# Altium schematic sheet Backlight.SchDoc
size A4
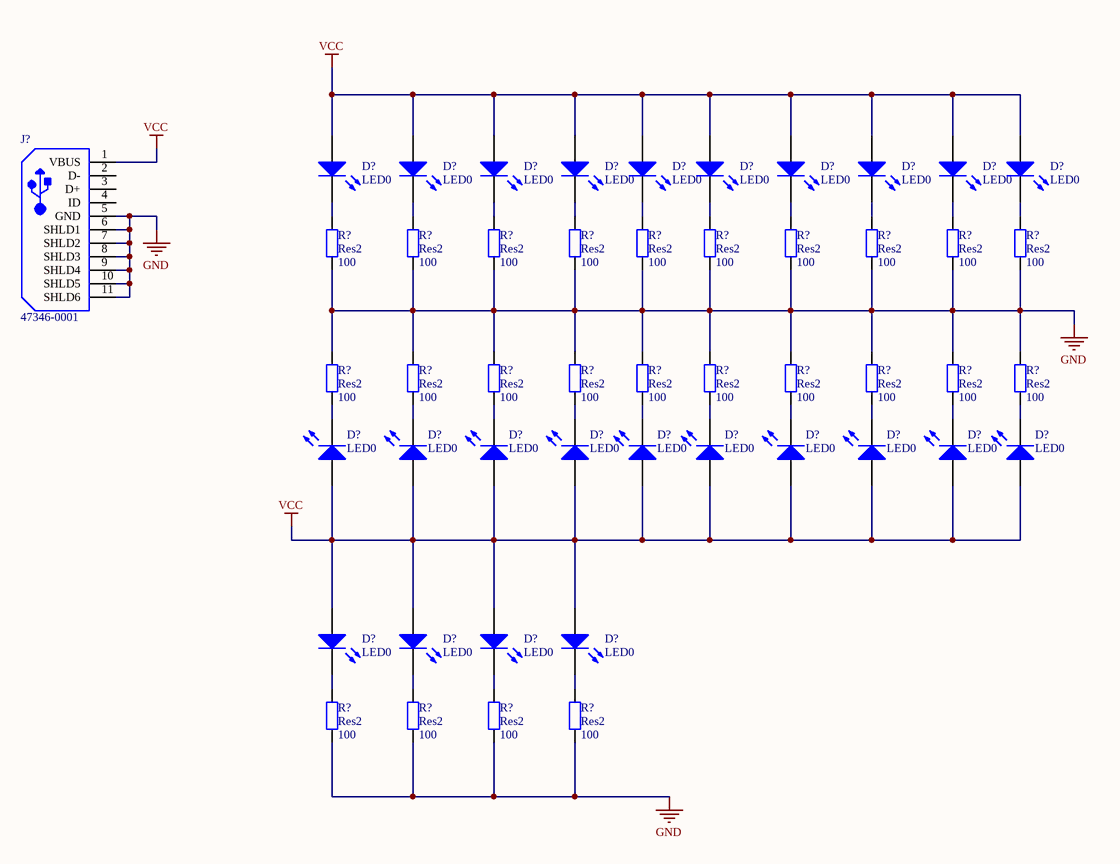
[diagram p0: Backlight.SchDoc]

## Parts
(Parts that share a designator on the sheet are numbered #1, #2 ... from top to bottom, then left to right.)
D?#1  LED0  [DIOC2012X06N]
D?#2  LED0  [DIOC2012X06N]
D?#3  LED0  [DIOC2012X06N]
D?#4  LED0  [DIOC2012X06N]
D?#5  LED0  [DIOC2012X06N]
D?#6  LED0  [DIOC2012X06N]
D?#7  LED0  [DIOC2012X06N]
D?#8  LED0  [DIOC2012X06N]
D?#9  LED0  [DIOC2012X06N]
D?#10  LED0  [DIOC2012X06N]
D?#11  LED0  [DIOC2012X06N]
D?#12  LED0  [DIOC2012X06N]
D?#13  LED0  [DIOC2012X06N]
D?#14  LED0  [DIOC2012X06N]
D?#15  LED0  [DIOC2012X06N]
D?#16  LED0  [DIOC2012X06N]
D?#17  LED0  [DIOC2012X06N]
D?#18  LED0  [DIOC2012X06N]
D?#19  LED0  [DIOC2012X06N]
D?#20  LED0  [DIOC2012X06N]
D?#21  LED0  [DIOC2012X06N]
D?#22  LED0  [DIOC2012X06N]
D?#23  LED0  [DIOC2012X06N]
D?#24  LED0  [DIOC2012X06N]
J?  47346-0001  [MOLX-47346-0001-5_V]
R?#1  Res2  value 100  [RESC2012X06N]
R?#2  Res2  value 100  [RESC2012X06N]
R?#3  Res2  value 100  [RESC2012X06N]
R?#4  Res2  value 100  [RESC2012X06N]
R?#5  Res2  value 100  [RESC2012X06N]
R?#6  Res2  value 100  [RESC2012X06N]
R?#7  Res2  value 100  [RESC2012X06N]
R?#8  Res2  value 100  [RESC2012X06N]
R?#9  Res2  value 100  [RESC2012X06N]
R?#10  Res2  value 100  [RESC2012X06N]
R?#11  Res2  value 100  [RESC2012X06N]
R?#12  Res2  value 100  [RESC2012X06N]
R?#13  Res2  value 100  [RESC2012X06N]
R?#14  Res2  value 100  [RESC2012X06N]
R?#15  Res2  value 100  [RESC2012X06N]
R?#16  Res2  value 100  [RESC2012X06N]
R?#17  Res2  value 100  [RESC2012X06N]
R?#18  Res2  value 100  [RESC2012X06N]
R?#19  Res2  value 100  [RESC2012X06N]
R?#20  Res2  value 100  [RESC2012X06N]
R?#21  Res2  value 100  [RESC2012X06N]
R?#22  Res2  value 100  [RESC2012X06N]
R?#23  Res2  value 100  [RESC2012X06N]
R?#24  Res2  value 100  [RESC2012X06N]

## Nets
GND: J?.5(GND) J?.6(SHLD1) J?.7(SHLD2) J?.8(SHLD3) J?.9(SHLD4) J?.10(SHLD5) J?.11(SHLD6) R?#1.1 R?#2.1 R?#3.1 R?#4.1 R?#5.1 R?#6.1 R?#7.1 R?#8.1 R?#9.1 R?#10.1 R?#11.1 R?#12.1 R?#13.1 R?#14.1 R?#15.1 R?#16.1 R?#17.1 R?#18.1 R?#19.1 R?#20.1 R?#21.1 R?#22.1 R?#23.1 R?#24.1
VCC: D?#1.1(A) D?#2.1(A) D?#3.1(A) D?#4.1(A) D?#5.1(A) D?#6.1(A) D?#7.1(A) D?#8.1(A) D?#9.1(A) D?#10.1(A) D?#11.1(A) D?#12.1(A) D?#13.1(A) D?#14.1(A) D?#15.1(A) D?#16.1(A) D?#17.1(A) D?#18.1(A) D?#19.1(A) D?#20.1(A) D?#21.1(A) D?#22.1(A) D?#23.1(A) D?#24.1(A) J?.1(VBUS)
NetD?#1_2: D?#1.2(K) R?#1.2
NetD?#2_2: D?#2.2(K) R?#2.2
NetD?#3_2: D?#3.2(K) R?#3.2
NetD?#4_2: D?#4.2(K) R?#4.2
NetD?#5_2: D?#5.2(K) R?#5.2
NetD?#6_2: D?#6.2(K) R?#6.2
NetD?#7_2: D?#7.2(K) R?#7.2
NetD?#8_2: D?#8.2(K) R?#8.2
NetD?#9_2: D?#9.2(K) R?#9.2
NetD?#10_2: D?#10.2(K) R?#10.2
NetD?#11_2: D?#11.2(K) R?#11.2
NetD?#12_2: D?#12.2(K) R?#12.2
NetD?#13_2: D?#13.2(K) R?#13.2
NetD?#14_2: D?#14.2(K) R?#14.2
NetD?#15_2: D?#15.2(K) R?#15.2
NetD?#16_2: D?#16.2(K) R?#16.2
NetD?#17_2: D?#17.2(K) R?#17.2
NetD?#18_2: D?#18.2(K) R?#18.2
NetD?#19_2: D?#19.2(K) R?#19.2
NetD?#20_2: D?#20.2(K) R?#20.2
NetD?#21_2: D?#21.2(K) R?#21.2
NetD?#22_2: D?#22.2(K) R?#22.2
NetD?#23_2: D?#23.2(K) R?#23.2
NetD?#24_2: D?#24.2(K) R?#24.2

Not connected (* = marked no-connect by the designer): J? 2(D-) 3(D+) 4(ID)

## Library data of the parts
D?#1-D?#24 = LED0: Typical INFRARED GaAs LED; Published: 8-Jun-2000; LatestRevisionDate: 08-Jul-2005; LatestRevisionNote: Mech Layer 1 removed.; PackageReference: LED-0; Publisher: Altium Limited; PackageDescription: LED; 2 Leads
J? = CMP-2000-05246-1: Micro-USB B Receptacle with Flange, -30 to 85 degC, 5-Pin SMD, RoHS, Tape and Reel; Manufacturer: Molex; Number of Contacts: 5; Body Orientation: RightAngle; Maximum Voltage Rating: 30VAC; Pitch: 0.65mm; Maximum Current Rating: 1.8/ContactA; Number of Ports: 1; Gender: RCP; Operating Temperature: -30to85C; Part No: 47346-0001; Color: Black; Termination Method: Solder; Contact Plating: GoldOverPalladiumNickelOverNickel; Dimension: 7.8x5.43x2.94mm; Number of Terminals: 5; Datasheet Version: Dec-13; Datasheet URL: https://datasheet.ciiva.com/30075/304740473460001-io-nectors-30075527.pdf; Contact Material: CopperAlloy; RoHS: Yes; Housing Material: LiquidCrystalPolymer; Manufacturer URL: http://www.molex.com/; Packaging: EmbossedTapeandReel; Mounting: SurfaceMount; Type: MicroUSBTypeB
R?#1-R?#24 = Res2: Resistor; Published: 8-Jun-2000; LatestRevisionDate: 17-Jul-2002; LatestRevisionNote: Re-released for DXP Platform.; PackageReference: AXIAL-0.4; Publisher: Altium Limited; PackageDescription: Axial Device, Thru-Hole; 2 Leads; 0.4 in Pin Spacing